# Altium schematic sheet MCU_ATMEGA328P.SchDoc: JDC 858D MAIN
size A4; DrawnBy: Huan; DocumentNumber: 1; Revision: 1.0; SheetNumber: 3; SheetTotal: 3
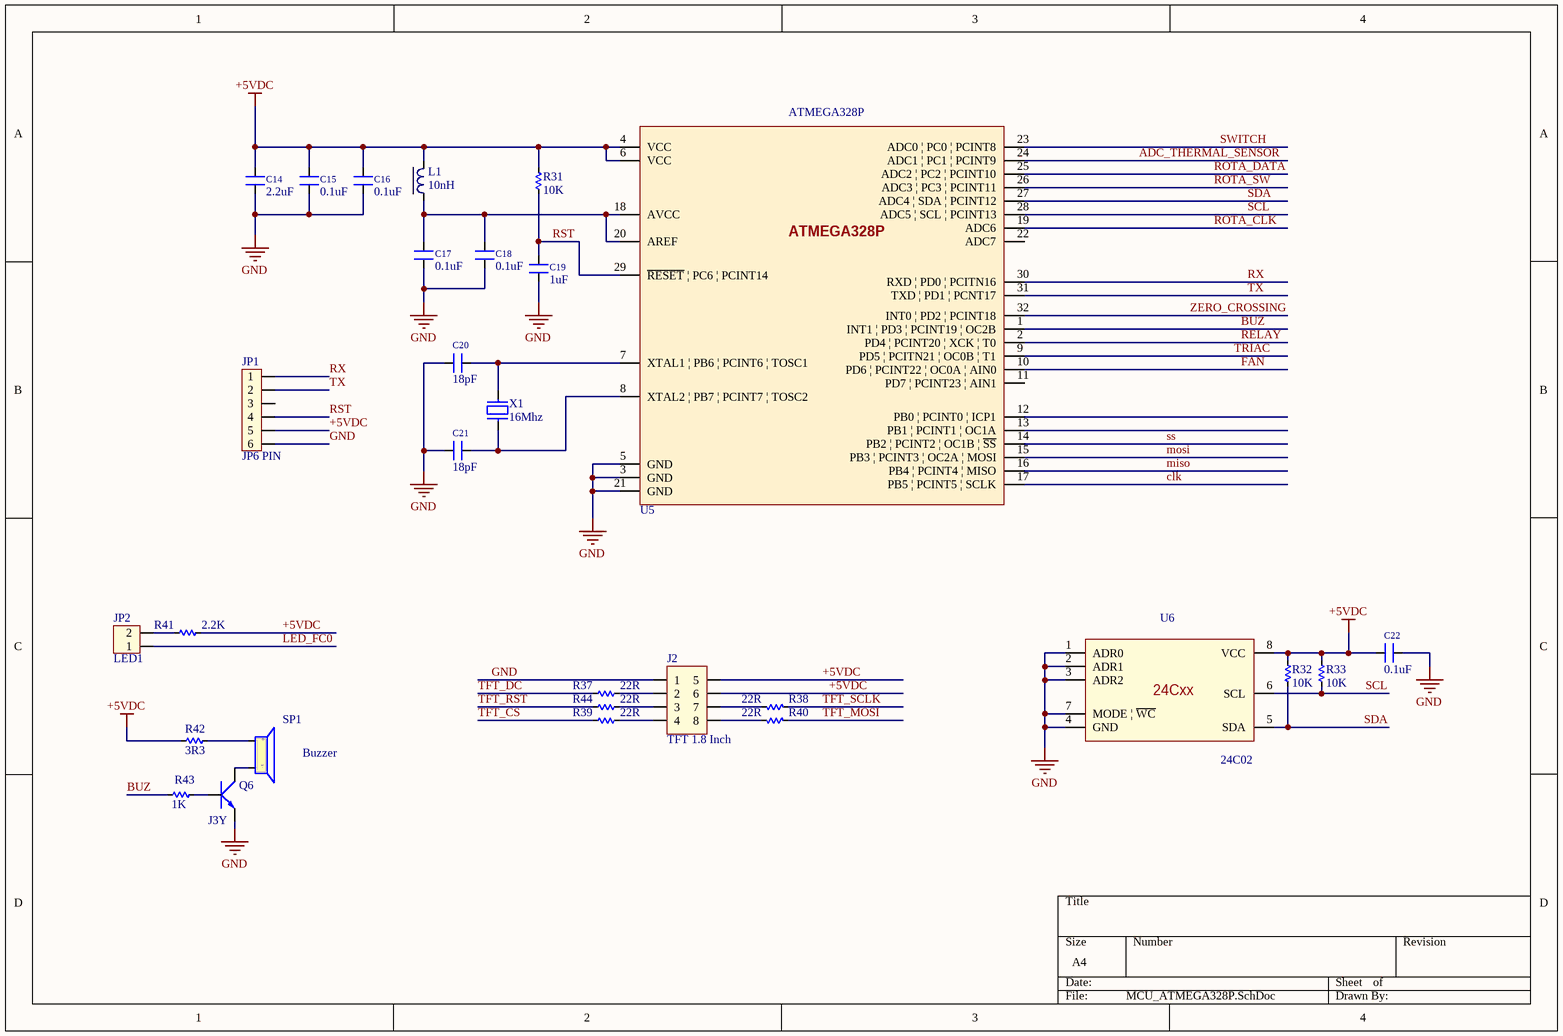
[diagram p0: MCU_ATMEGA328P.SchDoc]

## Parts
C14  2.2uF  [CN-SMD-1206]
C15  0.1uF  [CN-SMD-0805]
C16  0.1uF  [CN-SMD-0805]
C17  0.1uF  [CN-SMD-0805]
C18  0.1uF  [CN-SMD-0805]
C19  1uF  [CN-SMD-0805]
C20  18pF  [CN-SMD-0805]
C21  18pF  [CN-SMD-0805]
C22  0.1uF  [CN-SMD-0805]
J2  TFT 1.8 Inch  [JP4x2]
JP1  JP6 PIN  [JP6]
JP2  LED1  [CON2]
L1  10nH  [IN-SMD-0805]
Q6  J3Y  [SOT23B]
R31  10K  [RES-SMD-0603]
R32  10K  [RES-SMD-0603]
R33  10K  [RES-SMD-0603]
R37  22R  [RES-SMD-0603]
R38  22R  [RES-SMD-0603]
R39  22R  [RES-SMD-0603]
R40  22R  [RES-SMD-0603]
R41  2.2K  [RES-SMD-0603]
R42  3R3  [RES-SMD-0805]
R43  1K  [RES-SMD-0805]
R44  22R  [RES-SMD-0603]
SP1  Buzzer  [Buzzer]
U5  ATMEGA328P  [TQFP-32]
U6  24C02  [SOP-8]
X1  16Mhz  [XT-49S/DIP]

## Nets
+5VDC: C14.2 C15.2 C16.2 C22.2 J2.5 J2.6 JP1.5 L1.2 R31.1 R32.1 R33.1 R41.2 R42.1 U5.4(VCC) U5.6(VCC) U6.8(VCC)
GND: C14.1 C15.1 C16.1 C17.1 C18.1 C19.1 C20.2 C21.2 C22.1 J2.1 JP1.6 Q6.1(E) U5.3(GND) U5.5(GND) U5.21(GND) U6.1(ADR0) U6.2(ADR1) U6.3(ADR2) U6.4(GND) U6.7(MODE_|_~{WC})
ADC_THERMAL_SENSOR: U5.24(ADC1_|_PC1_|_PCINT9)
BUZ: R43.2 U5.1(INT1_|_PD3_|_PCINT19_|_OC2B)
clk: U5.17(PB5_|_PCINT5_|_SCLK)
FAN: U5.10(PD6_|_PCINT22_|_OC0A_|_AIN0)
LED_FC0: JP2.1
miso: U5.16(PB4_|_PCINT4_|_MISO)
mosi: U5.15(PB3_|_PCINT3_|_OC2A_|_MOSI)
RELAY: U5.2(PD4_|_PCINT20_|_XCK_|_T0)
ROTA_CLK: U5.19(ADC6)
ROTA_DATA: U5.25(ADC2_|_PC2_|_PCINT10)
ROTA_SW: U5.26(ADC3_|_PC3_|_PCINT11)
RST: C19.2 JP1.4 R31.2 U5.29(~{RESET}_|_PC6_|_PCINT14)
RX: JP1.1 U5.30(RXD_|_PD0_|_PCITN16)
SCL: R33.2 U5.28(ADC5_|_SCL_|_PCINT13) U6.6(SCL)
SDA: R32.2 U5.27(ADC4_|_SDA_|_PCINT12) U6.5(SDA)
ss: U5.14(PB2_|_PCINT2_|_OC1B_|_~{SS})
SWITCH: U5.23(ADC0_|_PC0_|_PCINT8)
TFT_CS: R39.1
TFT_DC: R37.1
TFT_MOSI: R40.1
TFT_RST: R44.1
TFT_SCLK: R38.1
TRIAC: U5.9(PD5_|_PCITN21_|_OC0B_|_T1)
TX: JP1.2 U5.31(TXD_|_PD1_|_PCNT17)
ZERO_CROSSING: U5.32(INT0_|_PD2_|_PCINT18)
NetC17_2: C17.2 C18.2 L1.1 U5.18(AVCC) U5.20(AREF)
NetC20_1: C20.1 U5.7(XTAL1_|_PB6_|_PCINT6_|_TOSC1) X1.1
NetC21_1: C21.1 U5.8(XTAL2_|_PB7_|_PCINT7_|_TOSC2) X1.2
NetJ2_2: J2.2 R37.2
NetJ2_3: J2.3 R44.2
NetJ2_4: J2.4 R39.2
NetJ2_7: J2.7 R38.2
NetJ2_8: J2.8 R40.2
NetJP2_2: JP2.2 R41.1
NetQ6_2: Q6.2(B) R43.1
NetQ6_3: Q6.3(C) SP1.2
NetR42_2: R42.2 SP1.1

Not connected (* = marked no-connect by the designer): JP1 3; U5 11(PD7_|_PCINT23_|_AIN1) 12(PB0_|_PCINT0_|_ICP1) 13(PB1_|_PCINT1_|_OC1A) 22(ADC7)

## Notes on the sheet
- (in symbol Buzzer_5V) +; -

## Library data of the parts
C14-C22 = CAP SMD: Value: 0,1uF/300V; Designed by: VanDungEvn
J2 = JP4x2: Connector 4x2; Value: Connector 4x2
JP1 = JP6: Value: JP7
JP2 = Con2: Connector 2; Value: Connector 2
L1 = inductor-SMD: Value: 150 mH
Q6 = 2N222: NPN 600mW, ECB; pin to pad: 1>2 2>1; Value: C1815
R31-R33 R37-R44 = Res-SMD: Resistor; Manufacturer: Generic Components; Class: Passive; Published: 08/06/2000; Publisher: Altium Hobart Technology Centre
SP1 = Buzzer_5V
U6 = 24Cxx: SERIAL EEPROM
X1 = XTAL: crystal; Value: 4Mhz